# Altium schematic sheet PRINCIPAL_SCH.SchDoc
size A4; SheetNumber: 2; SheetTotal: 3
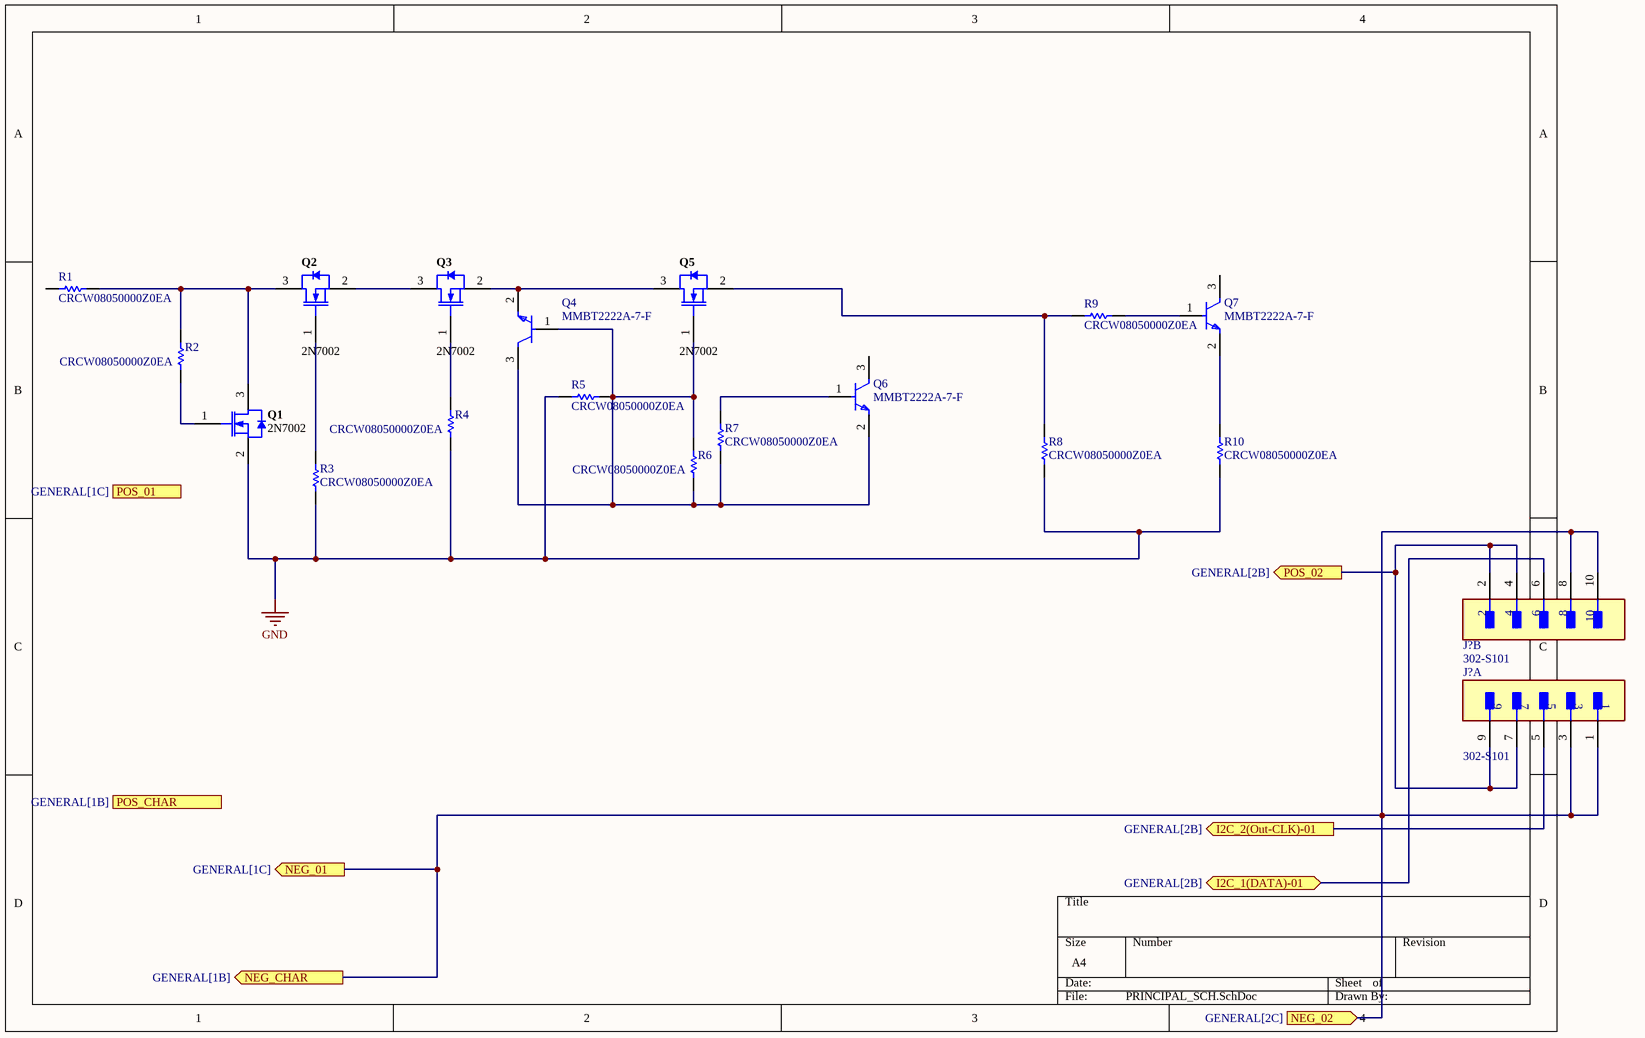
[diagram p0: PRINCIPAL_SCH.SchDoc]

## Parts
(Parts that share a designator on the sheet are numbered #1, #2 ... from top to bottom, then left to right.)
J?#1  302-S101  [FP-302-S101-MFG]  (part B of 2)
J?#2  302-S101  [FP-302-S101-MFG]  (part A of 2)
Q1  2N7002  [INF-PG-SOT23_M]
Q2  2N7002  [INF-PG-SOT23_M]
Q3  2N7002  [INF-PG-SOT23_M]
Q4  MMBT2222A-7-F  [FP-SOT23-IPC_A]
Q5  2N7002  [INF-PG-SOT23_M]
Q6  MMBT2222A-7-F  [FP-SOT23-IPC_A]
Q7  MMBT2222A-7-F  [FP-SOT23-IPC_A]
R1  CRCW08050000Z0EA  [RESC2013X50X30LL20T20]
R2  CRCW08050000Z0EA  [RESC2013X50X30LL20T20]
R3  CRCW08050000Z0EA  [RESC2013X50X30LL20T20]
R4  CRCW08050000Z0EA  [RESC2013X50X30LL20T20]
R5  CRCW08050000Z0EA  [RESC2013X50X30LL20T20]
R6  CRCW08050000Z0EA  [RESC2013X50X30LL20T20]
R7  CRCW08050000Z0EA  [RESC2013X50X30LL20T20]
R8  CRCW08050000Z0EA  [RESC2013X50X30LL20T20]
R9  CRCW08050000Z0EA  [RESC2013X50X30LL20T20]
R10  CRCW08050000Z0EA  [RESC2013X50X30LL20T20]

## Ports
I2C_1(DATA)-01 (bidir, see GENERAL[2B]), I2C_2(Out-CLK)-01 (out, see GENERAL[2B]), NEG_01 (out, see GENERAL[1C]), NEG_02 (in, see GENERAL[2C]), NEG_CHAR (out, see GENERAL[1B]), POS_01 (in, see GENERAL[1C]), POS_02 (out, see GENERAL[2B]), POS_CHAR (in, see GENERAL[1B])

## Nets
GND: Q1.2(SOURCE) R3.1 R4.1 R5.1 R8.1 R10.1
I2C_1(DATA)-01: J?#1.6 ; port I2C_1(DATA)-01
I2C_2(Out-CLK)-01: J?#2.5 ; port I2C_2(Out-CLK)-01
NEG_01: J?#1.8 J?#1.10 J?#2.1 J?#2.3 ; port NEG_02, port NEG_01, port NEG_CHAR
POS_02: J?#1.2 J?#1.4 J?#2.7 J?#2.9 ; port POS_02
NetQ1_1: Q1.1(GATE) R2.1
NetQ1_3: Q1.3(DRAIN) Q2.3(DRAIN) R1.2 R2.2
NetQ2_1: Q2.1(GATE) R3.2
NetQ2_2: Q2.2(SOURCE) Q3.3(DRAIN)
NetQ3_1: Q3.1(GATE) R4.2
NetQ3_2: Q3.2(SOURCE) Q4.2(E) Q5.3(DRAIN)
NetQ4_1: Q4.1(B) Q4.3(C) Q5.1(GATE) Q6.2(E) R5.2 R6.1 R6.2 R7.2
NetQ5_2: Q5.2(SOURCE) R8.2 R9.1
NetQ6_1: Q6.1(B) R7.1
NetQ7_1: Q7.1(B) R9.2
NetQ7_2: Q7.2(E) R10.2

Not connected (* = marked no-connect by the designer): Q6 3(C); Q7 3(C); R1 1

## Library data of the parts
J?#1 J?#2 = CMP-15228-000002-1: CONN HEADER VERT 10POS 2.54MM; Voltage Rating: 250V; Row Spacing: 0.1inch; Number of Positions: 10; Mount: Through Hole; Series: 302; Contact Type: Male Pin; Contact Plating: Gold; Contact Material: Brass; Number of Rows: 2; Color: Black; Contact Finish - Mating: GOLD; Packaging: Bulk; Pitch: 0.1inch; Fastening Type: Pull; Insulation Color: Black; Termination: Solder; Flammability Rating: UL94 V-0; Connector Type: Header; Max Operating Temperature: 105°C; Insulation Material: Glass; Contact Shape: Square; Min Operating Temperature: -40°C
Q1-Q3 Q5 = CMP-1149-00026-1: N-Channel OptiMOS Small-Signal-Transistor, 60 V VDS, 0.3 A ID, -55 to 150 degC, PG-SOT23, Reel, Green; Manufacturer: Infineon; RDS (on) (max) (@4.5V): 4,000 mOhm; VDS (max): 60 V; IDpuls (max): 1.2Â A; QG: 0.4Â nC; RDS (on) (max): 3,000 mOhm; RthJA (max): 250 K/W; ID (max): 0.3Â A; VGS(th) (max): 2.5Â V; VGS(th) (min): 1.5Â V; Green: TRUE; Ptot (max): 0.5Â W; PackageDescription: 3-Pin Small Outline Transistor Package, 2.9 x 1.3 mm Body, 0.95 mm Pitch; Halogen-free: TRUE; ComponentLink2Description: Datasheet; ComponentLink1URL: http://www.infineon.com/; Packing: Reel; DatasheetVersion: Rev. 2.4; PartNumber: 2N7002; PackageReference: PG-SOT23; PackageVersion: Apr-08; ComponentLink3URL: http://www.infineon.com/dgdl/SOT23-Package_Overview.pdf?folderId=db3a30431936bc4b0119532290053c66&fileId=db3a30431936bc4b0119533468123c85; ComponentLink1Description: Manufacturer URL; Mounting Technology: Surface Mount; ComponentLink3Description: Package Specification; ComponentLink2URL: http://www.infineon.com/dgdl/2N7002_Rev2.4.pdf?folderId=db3a3043156fd573011622e10b5c1f67&fileId=db3a304319bc939a0119c2a9461e79e6
Q4 Q6 Q7 = CMP-1693-00003-4: TRANS NPN 40V 0.6A SMD SOT23-3; Number of Elements: 1; Frequency: 300MHz; Max Collector Current: 600mA; Collector Base Voltage (VCBO): 75V; Current: 1A; Element Configuration: Single; Power Dissipation: 350mW; hFE Min: 100; Collector Emitter Saturation Voltage: 1V; Max Power Dissipation: 300mW; Emitter Base Voltage (VEBO): 6V; Voltage: 40V; Collector Emitter Breakdown Voltage: 40V; Width: 1.4mm; Polarity: NPN; Termination: SMD/SMT; Max Operating Temperature: 150°C; Transition Frequency: 300MHz; Contact Plating: Tin; Mount: Surface Mount; Max Frequency: 300MHz; Case/Package: SOT-23; Gain Bandwidth Product: 300MHz; Lead Free: Lead Free; Collector Emitter Voltage (VCEO): 40V; Radiation Hardening: No; Voltage Rating (DC): 40V; Height: 1mm; Max Breakdown Voltage: 40V; Packaging: Tape and Reel; Length: 3.05mm; Min Operating Temperature: -55°C; Weight: 0.000282oz; Current Rating: 600mA; REACH SVHC: No SVHC; Package Quantity: 3000; Continuous Collector Current: 600mA; Number of Pins: 3
R1-R10 = CMP-2001-04896-1: Manufacturer: Vishay Dale; Part Number: CRCW08050000Z0EA